# Altium schematic sheet 06_I2C_DS3231.SchDoc
size A3; SheetNumber: 5; SheetTotal: 5
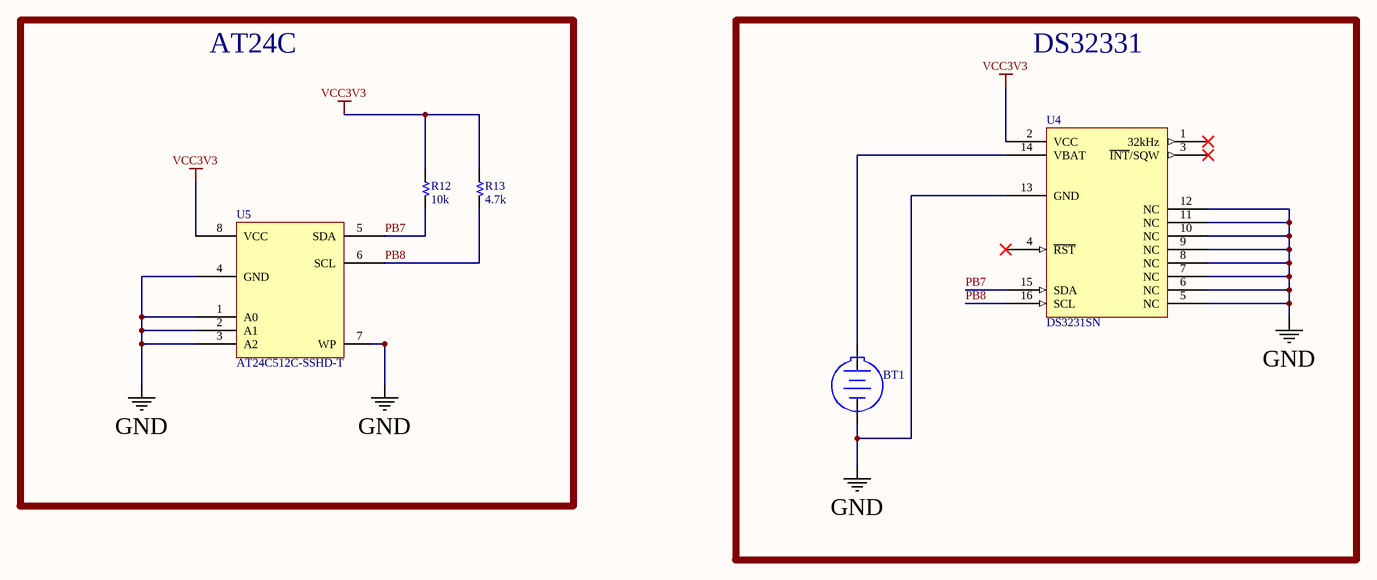
[diagram p0: 06_I2C_DS3231.SchDoc]

## Parts
BT1  79527141  [79527141]  (value not drawn)
R12  10k  [R 0805]
R13  4.7k  [R 0805]
U4  DS3231SN  [DS3231SN-16SOIC]
U5  AT24C512C-SSHD-T  [M24M01-RMN6TP]

## Blocks framed on the sheet
AT24C: R12 R13 U5
DS32331: BT1 U4

## Nets
GND: BT1.2(-) U4.5(NC) U4.6(NC) U4.7(NC) U4.8(NC) U4.9(NC) U4.10(NC) U4.11(NC) U4.12(NC) U4.13(GND) U5.1(A0) U5.2(A1) U5.3(A2) U5.4(GND) U5.7(WP)
VCC3V3: R12.1 R13.1 U4.2(VCC) U5.8(VCC)
PB7: R12.2 U4.15(SDA) U5.5(SDA)
PB8: R13.2 U4.16(SCL) U5.6(SCL)
NetBT1_1: BT1.1(+) U4.14(VBAT)

Not connected (* = marked no-connect by the designer): U4 1(32kHz)* 3(~{INT}/SQW)* 4(~{RST})*

## Library data of the parts
BT1 = 79527141: WA-BCPH Battery Holder, SMT, battery type 2032; Manufacturer: Wurth Elektronik; Battery Type: 2032; ComponentLink1Description: Website Link; ComponentLink1URL: https://www.we-online.com/redexpert/article/79527141?ad; ComponentLink2Description: Datasheet Link; ComponentLink2URL: https://www.we-online.com/redexpert/spec/79527141?ad; Manufacturer Part Number: 79527141; Category: Battery Holders; Match Code: WA-BCPH; Mount: Surface Mount; Operating Temperature Max: 105°C; Operating Temperature Min: -40°C; Packaging: Tape and Reel
R12 R13 = Resistor
U4 = DS3231SN-16SOIC: IC RTC CLK/CALENDAR I2C 16SOIC; Manufacturer: Analog Devices Inc./Maxim Integrated; Operating Supply Current: 110 - 170 (µA); RTC Bus Interface: I2C, Serial; Time Format: HH:MM:SS (12 hr, 24 hr); Supply Voltage - Max: 5.5 V; Supply Voltage - Min: 2.3 V; RTC Memory Size: N/A; Supplier 1 URL: https://www.mouser.com/ProductDetail/Analog-Devices-Maxim-Integrated/DS3231SN?qs=ffX8NcjNb2RmKAb9wAk9Ug%3D%3D; Supplier 2 URL: https://www.digikey.com/en/products/detail/analog-devices-inc-maxim-integrated/DS3231SN/1197576; Supplier 3 URL: https://www.thegioiic.com/ds3231sn-ic-rtc-clock-calendar-16-soic; Value: DS3231SN; Manufacturer Part Number: DS3231SN; Supplier 1: Mouser; Supplier 1 Part Number: 700-DS3231SN-; Supplier 2: Digi-Key; Supplier 2 Part Number: DS3231SN#-ND; Supplier 3: thegioiic; Supplier 3 Part Number: N/A; Mount: SMD/SMT; Operating Temperature Max: + 85 C; Operating Temperature Min: - 40 C; Package / Case: SOIC-16; Packaging: Tape and Reel; ComponentLink1Description: Datasheet; ComponentLink1URL: https://www.analog.com/media/en/technical-documentation/data-sheets/DS3231.pdf; LCSC Part #: N/A
U5 = AT24C512C-SSHD-T: EEPROM SERIAL EEPROM 512K (64K X 8) 2WIRE 2.5V; Manufacturer: Microchip; Interface Type: 2-Wire, I2C; Maximum Clock Frequency: 1 MHz; Memory Size: 512 kbit; Supply Voltage - Max: 5.5 V; Supplier 1 URL: https://www.mouser.vn/ProductDetail/Microchip-Technology/AT24C512C-SSHD-T?qs=Oaf4mloV4cM7Q6xetGfOtg%3D%3D; Supplier 2 URL: https://www.digikey.com/en/products/detail/microchip-technology/at24c512c-sshd-t/3046245; Supplier 3 URL: https://www.thegioiic.com/at24c512c-sshd-t-ic-eeprom-512kbit-8-soic; Value: AT24C512C-SSHD-T; Manufacturer Part Number: AT24C512C-SSHD-T; Supplier 1: Mouser; Supplier 1 Part Number: 556-AT24C512C-SSHD-T; Supplier 2: Digi-Key; Supplier 2 Part Number: AT24C512C-SSHD-TTR-ND; Supplier 3: thegioiic; Supplier 3 Part Number: AT24C512C-SSHD-T; Mount: SMD/SMT; Operating Temperature Max: + 85 C; Operating Temperature Min: - 40 C; Package / Case: SOIC-8; Packaging: Tape and Reel; Supply Voltage - Min: 2.5 V; ComponentLink1Description: Datasheet; ComponentLink1URL: https://www.mouser.vn/datasheet/2/268/AT24C512C_I_c2_b2C_Compatible__Two_Wire__Serial_EE-2306430.pdf; LCSC Part #: C12371